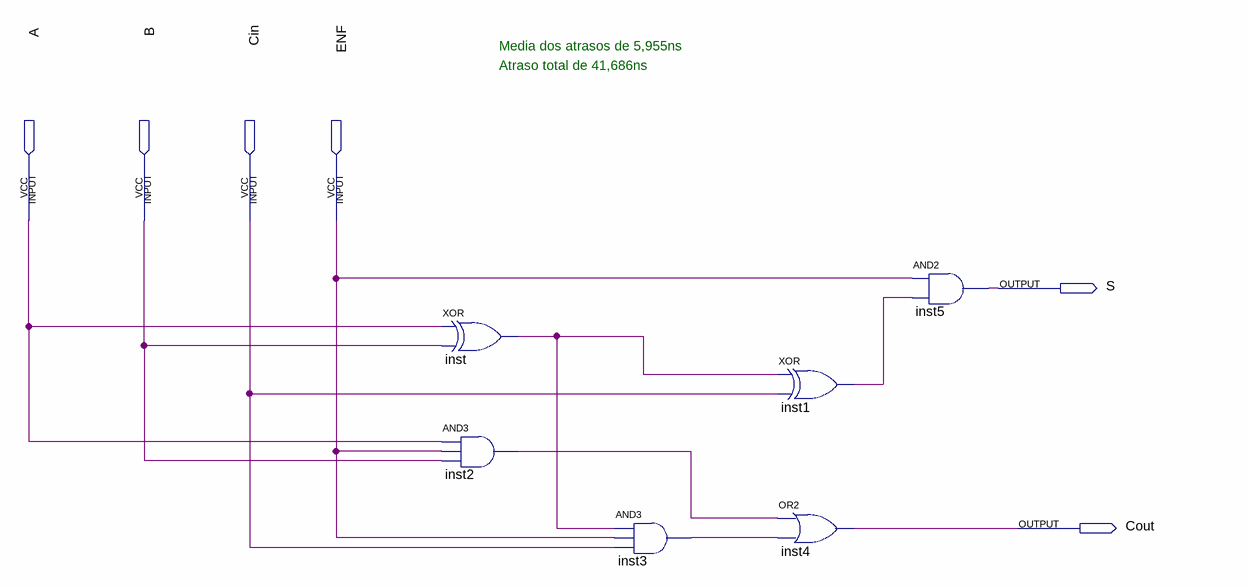
[diagram p0: schematic sheet]
// Quartus schematic FULL_ADDER_1bit.bdf as structural Verilog: 6 symbols, 6 pins
module FULL_ADDER_1bit (
  input  A,
  input  B,
  input  Cin,
  input  ENF,
  output S,
  output Cout
);

  wire inst1_out, inst2_out, inst3_out, inst_out;

  xor inst (inst_out, A, B);
  and inst2 (inst2_out, A, ENF, B);
  and inst3 (inst3_out, inst_out, ENF, Cin);
  xor inst1 (inst1_out, inst_out, Cin);
  or inst4 (Cout, inst2_out, inst3_out);
  and inst5 (S, ENF, inst1_out);

  // Notes on the sheet:
  //   Media dos atrasos de 5,955ns
  //   Atraso total de 41,686ns
endmodule
